# EAGLE schematic EQTest (EAGLE 9.1.2)
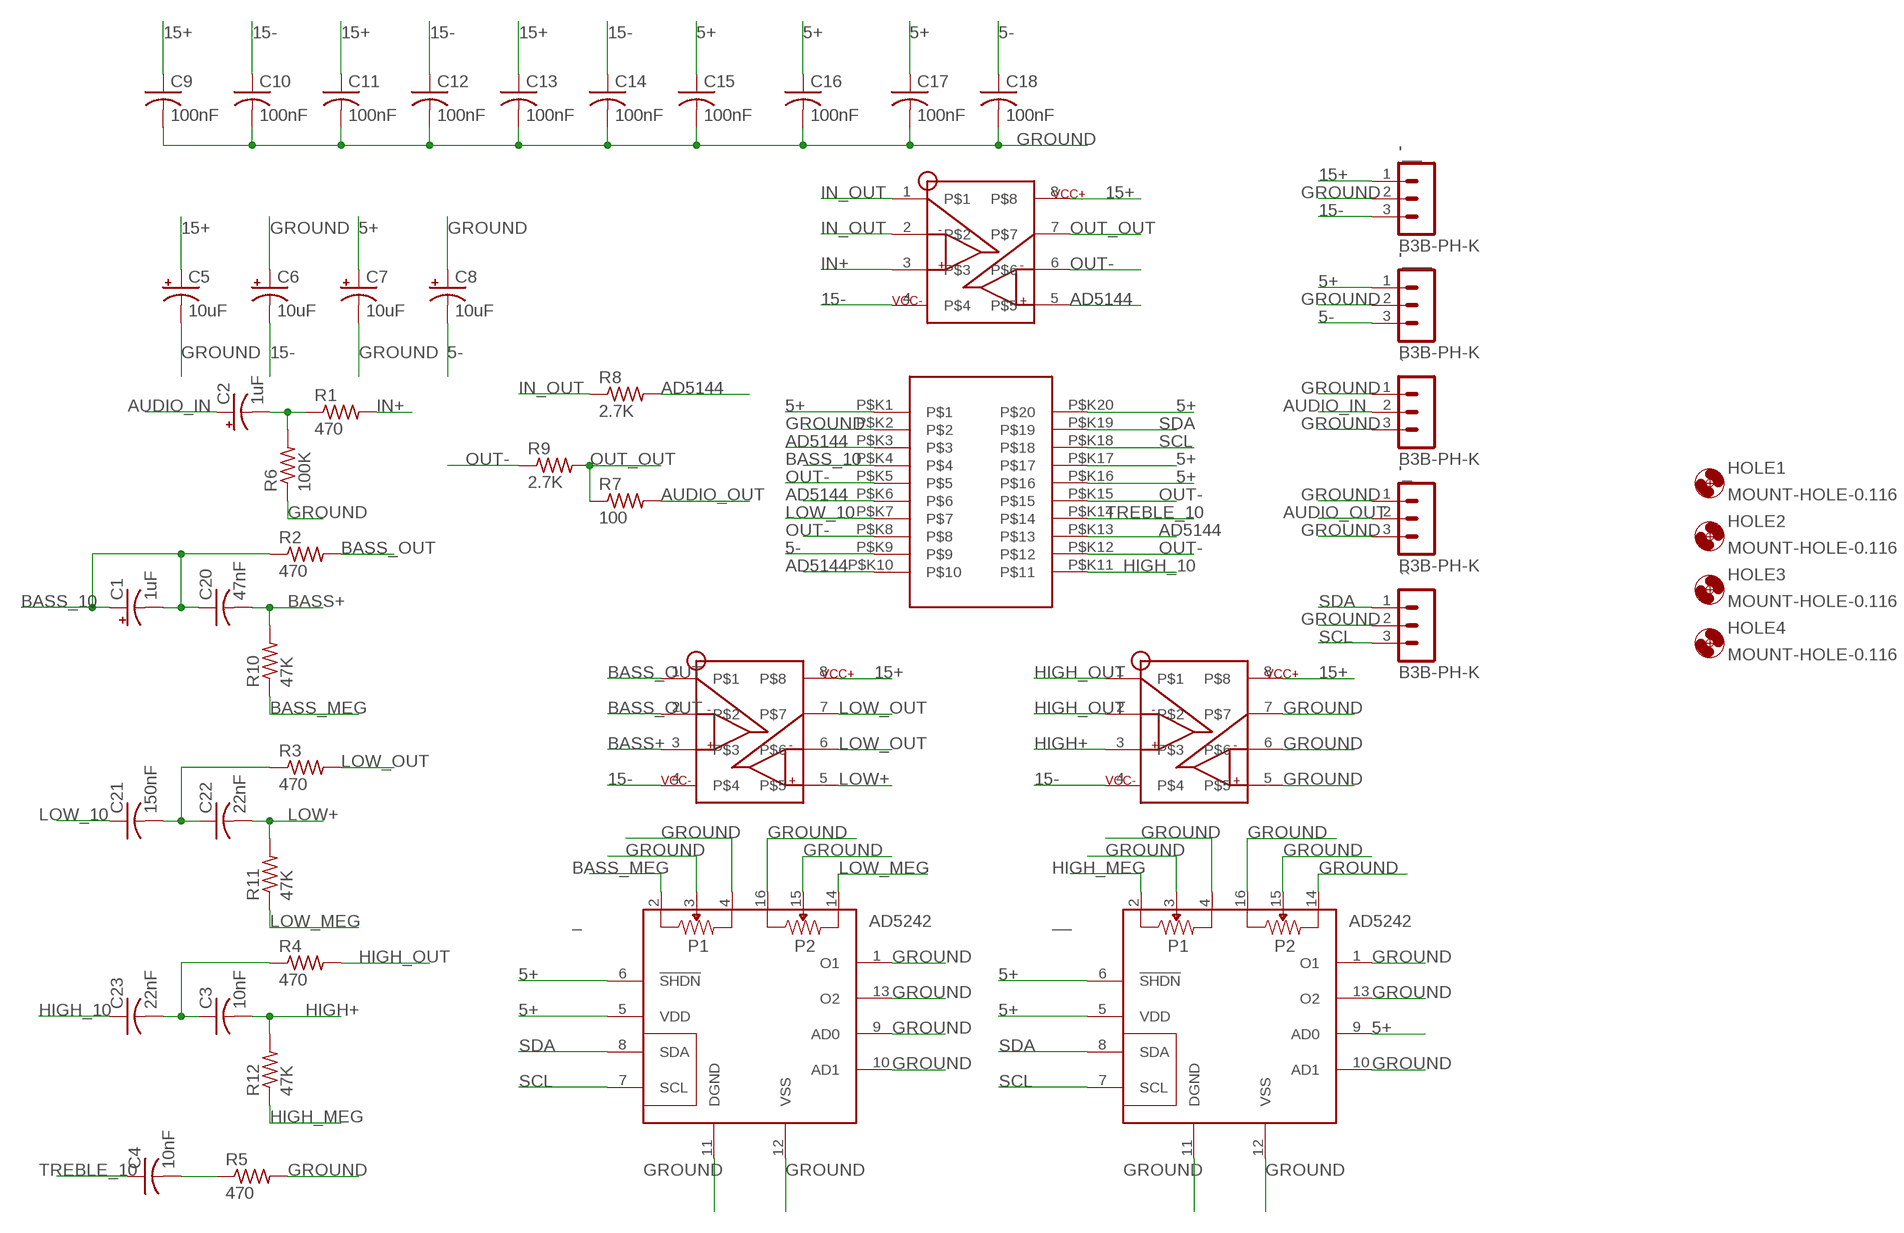
[diagram p0: schematic, sheet 1]

## Parts
10K  TSSOP20  [TSSOP20]
'  NE5532  [SO08]
''  NE5532  [SO08]
'''  NE5532  [SO08]
'_  B3B-PH-K  [B3B-PH-K]
'__  B3B-PH-K  [B3B-PH-K]
'___  B3B-PH-K  [B3B-PH-K]
_  AD5242  [TSSOP16]
__  AD5242  [TSSOP16]
`  B3B-PH-K  [B3B-PH-K]
``  B3B-PH-K  [B3B-PH-K]
C1  1uF  CPOL-USE2-5  [E2-5]
C2  1uF  CPOL-USE2-5  [E2-5]
C3  10nF  C-USC1206K  [C1206K]
C4  10nF  C-USC1206K  [C1206K]
C5  10uF  CPOL-USE3.5-8  [E3,5-8]
C6  10uF  CPOL-USE3.5-8  [E3,5-8]
C7  10uF  CPOL-USE3.5-8  [E3,5-8]
C8  10uF  CPOL-USE3.5-8  [E3,5-8]
C9  100nF  C-USC1206K  [C1206K]
C10  100nF  C-USC1206K  [C1206K]
C11  100nF  C-USC1206K  [C1206K]
C12  100nF  C-USC1206K  [C1206K]
C13  100nF  C-USC1206K  [C1206K]
C14  100nF  C-USC1206K  [C1206K]
C15  100nF  C-USC1206K  [C1206K]
C16  100nF  C-USC1206K  [C1206K]
C17  100nF  C-USC1206K  [C1206K]
C18  100nF  C-USC1206K  [C1206K]
C20  47nF  C-USC1206K  [C1206K]
C21  150nF  C-USC1206K  [C1206K]
C22  22nF  C-USC1206K  [C1206K]
C23  22nF  C-USC1206K  [C1206K]
HOLE1  MOUNT-HOLE-0.116  [116]
HOLE2  MOUNT-HOLE-0.116  [116]
HOLE3  MOUNT-HOLE-0.116  [116]
HOLE4  MOUNT-HOLE-0.116  [116]
R1  470  R-US_R1206  [R1206]
R2  470  R-US_R1206  [R1206]
R3  470  R-US_R1206  [R1206]
R4  470  R-US_R1206  [R1206]
R5  470  R-US_R1206  [R1206]
R6  100K  R-US_R1206  [R1206]
R7  100  R-US_R1206  [R1206]
R8  2.7K  R-US_R1206  [R1206]
R9  2.7K  R-US_R1206  [R1206]
R10  47K  R-US_R1206  [R1206]
R11  47K  R-US_R1206  [R1206]
R12  47K  R-US_R1206  [R1206]

## Nets
5+: 10K.P$K1 10K.P$K16 10K.P$K17 10K.P$K20 '___.1 _.5(VDD) _.6(!SHDN) __.5(VDD) __.6(!SHDN) __.9(AD0) C7.+ C15.1 C16.1 C17.1
5-: 10K.P$K9 '___.3 C8.- C18.1
15+: '''.8 ''.8 '.8 '__.1 C5.+ C9.1 C11.1 C13.1
15-: '''.4 ''.4 '.4 '__.3 C6.- C10.1 C12.1 C14.1
AD5144: 10K.P$K3 10K.P$K6 10K.P$K10 10K.P$K13 '.5 R8.2
AUDIO_IN: `.2 C2.+
AUDIO_OUT: '_.2 R7.2
BASS+: ''.3 C20.2 R10.2
BASS_10: 10K.P$K4 C1.+ C1.- C20.1 R2.1
BASS_MEG: _.2(A1) R10.1
BASS_OUT: ''.1 ''.2 R2.2
GROUND: 10K.P$K2 '''.5 '''.6 '''.7 '_.1 '_.3 '__.2 '___.2 _.1(O1) _.3(W1) _.4(B1) _.9(AD0) _.10(AD1) _.11(DGND) _.12(VSS) _.13(O2) _.15(W2) _.16(A2) __.1(O1) __.3(W1) __.4(B1) __.10(AD1) __.11(DGND) __.12(VSS) __.13(O2) __.14(B2) __.15(W2) __.16(A2) `.1 `.3 ``.2 C5.- C6.+ C7.- C8.+ C9.2 C10.2 C11.2 C12.2 C13.2 C14.2 C15.2 C16.2 C17.2 C18.2 R5.2 R6.1
HIGH+: '''.3 C3.2 R12.2
HIGH_10: 10K.P$K11 C23.1
HIGH_MEG: __.2(A1) R12.1
HIGH_OUT: '''.1 '''.2 R4.2
IN+: '.3 R1.2
IN_OUT: '.1 '.2 R8.1
LOW+: ''.5 C22.2 R11.2
LOW_10: 10K.P$K7 C21.1
LOW_MEG: _.14(B2) R11.1
LOW_OUT: ''.6 ''.7 R3.2
N$2: C4.2 R5.1
N$22: C3.1 C23.2 R4.1
N$23: C21.2 C22.1 R3.1
N$77: C2.- R1.1 R6.2
OUT-: 10K.P$K5 10K.P$K8 10K.P$K12 10K.P$K15 '.6 R9.1
OUT_OUT: '.7 R7.1 R9.2
SCL: 10K.P$K18 _.7(SCL) __.7(SCL) ``.3
SDA: 10K.P$K19 _.8(SDA) __.8(SDA) ``.1
TREBLE_10: 10K.P$K14 C4.1

## Library data of the parts
10K = kevin:TSSOP20
' '' ''' = ne5532:NE5532
'_ '__ '___ ` `` = con-jst-ph:B3B-PH-K: HEADER
_ __ = ad5242:AD5242: AD5242: I2C-Compatible, 256-Position Digital Potentiometers The AD5241/AD5242 provide a single-/dual-channel, 256- position, digitally controlled variable resistor (VR) device. These devices perform the same electronic adjustment function as a potentiometer, trimmer, or variable resistor. Each VR offers a completely programmable value of resistance between the A terminal and the wiper, or the B terminal and the wiper. For the AD5242, the fixed A-to-B terminal resistance of 10 kΩ, 100 kΩ, or 1 MΩ has a 1% channel-to-channel matching tolerance. Zero position is 60Ω.
C1 C2 C5-C8 = rcl:CPOL-US: POLARIZED CAPACITOR, American symbol; SPICEPREFIX: C
C3 C4 C9-C18 C20-C23 = rcl:C-US: CAPACITOR, American symbol; SPICEPREFIX: C
HOLE1-HOLE4 = holes:MOUNT-HOLE-: MOUNTING HOLE with drill center marker; BOM: EXCLUDE
R1-R12 = rcl:R-US_: RESISTOR, American symbol; SPICEPREFIX: R